# Altium project CoredunioNet_Project.PrjPcb
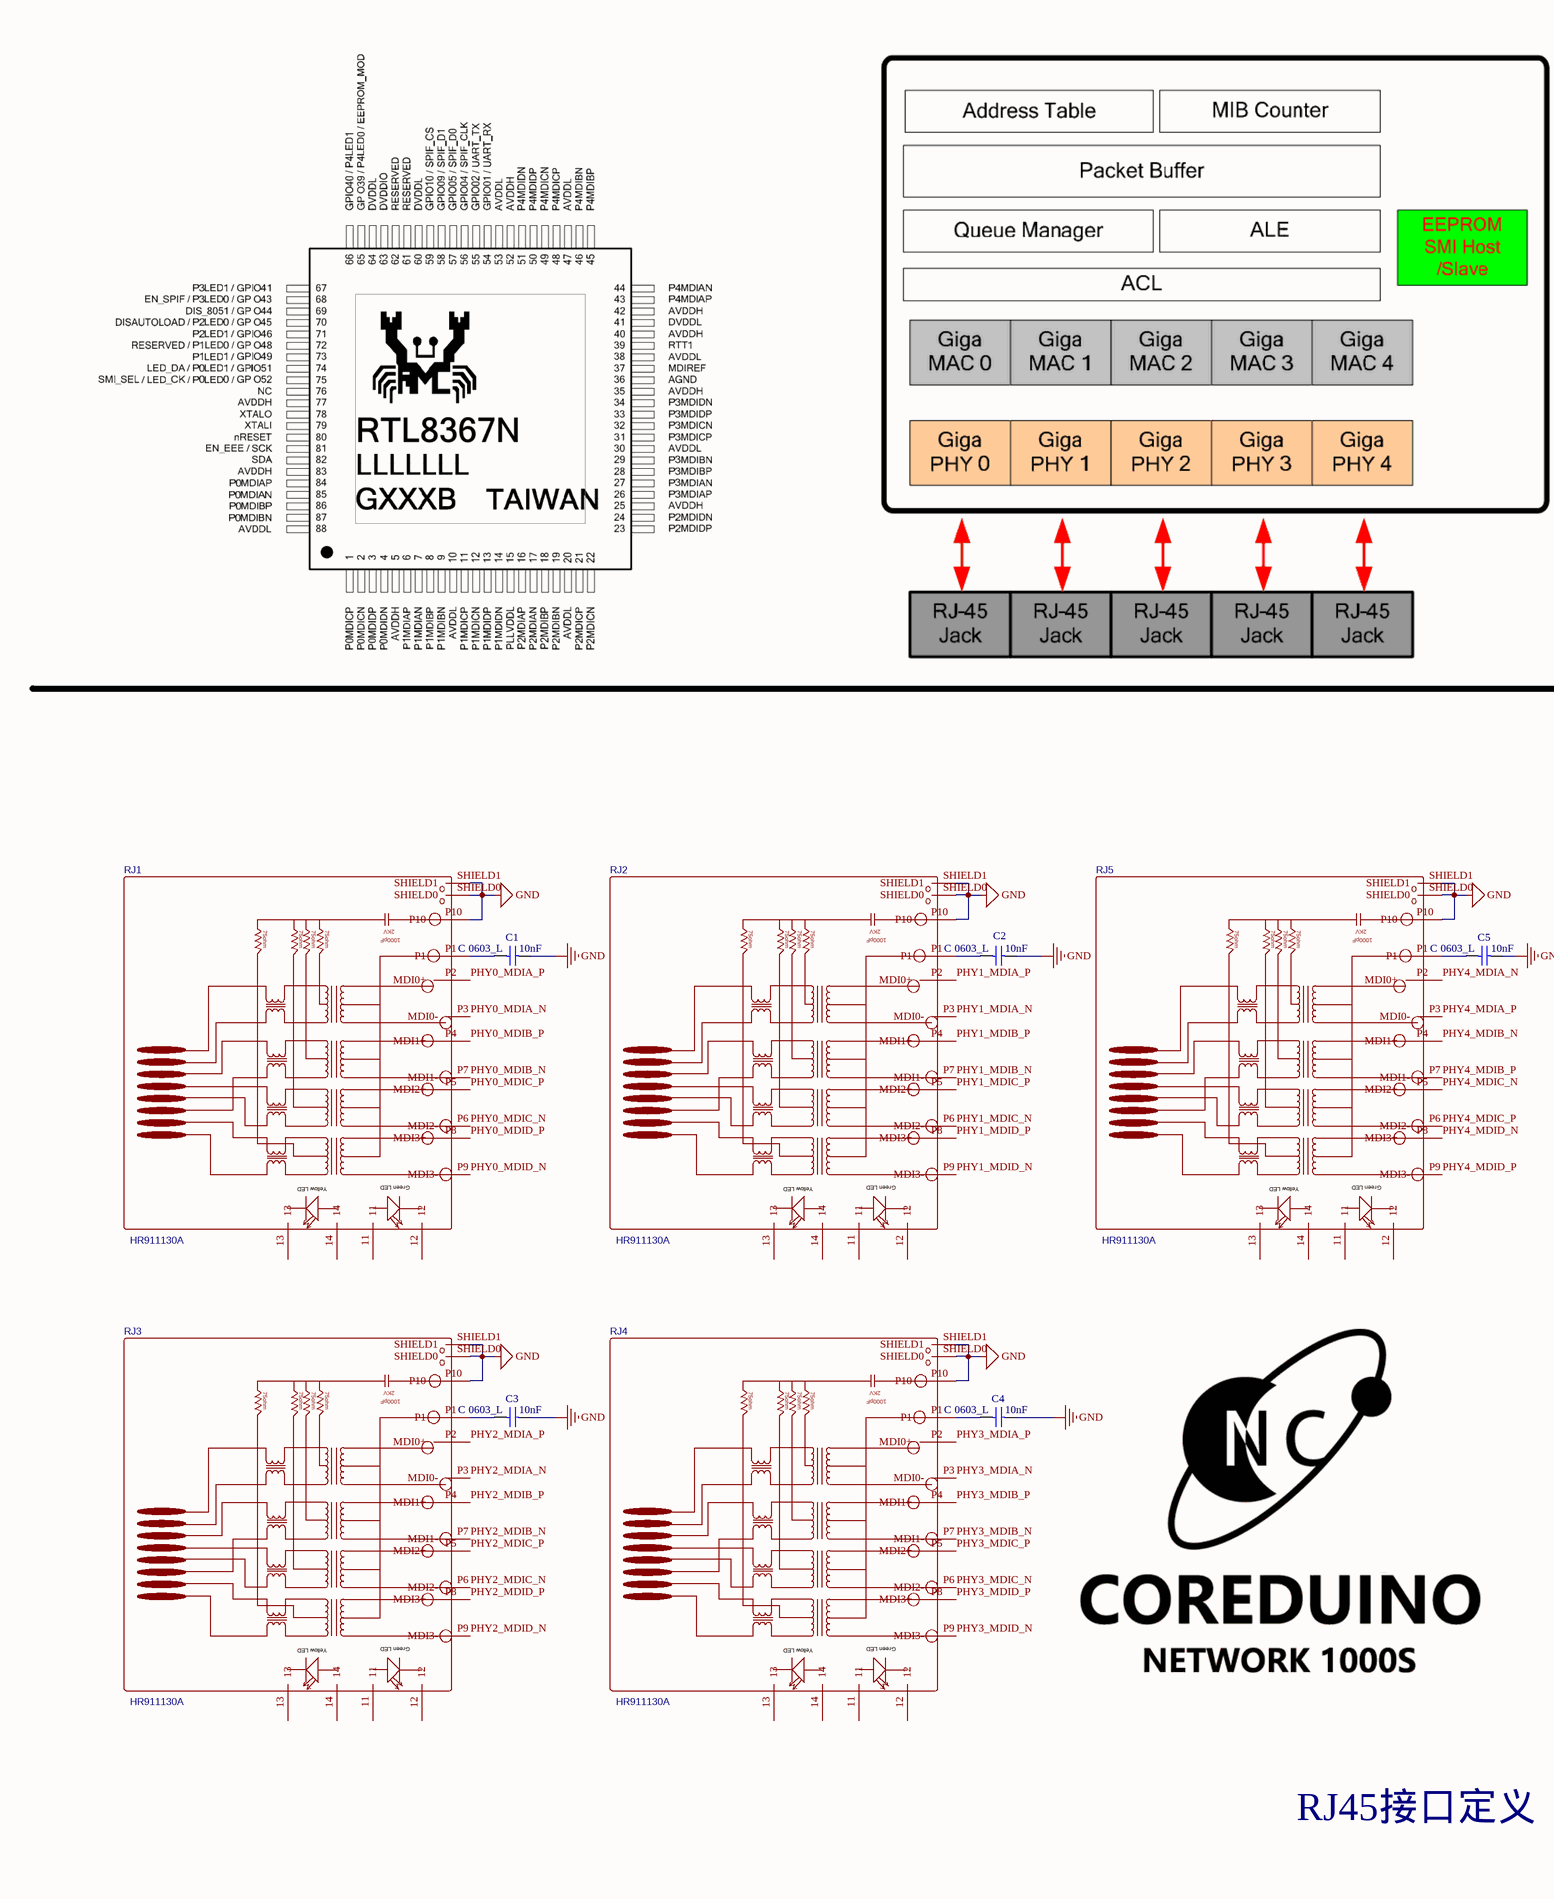
[diagram p0: Sheet1.SchDoc, left]
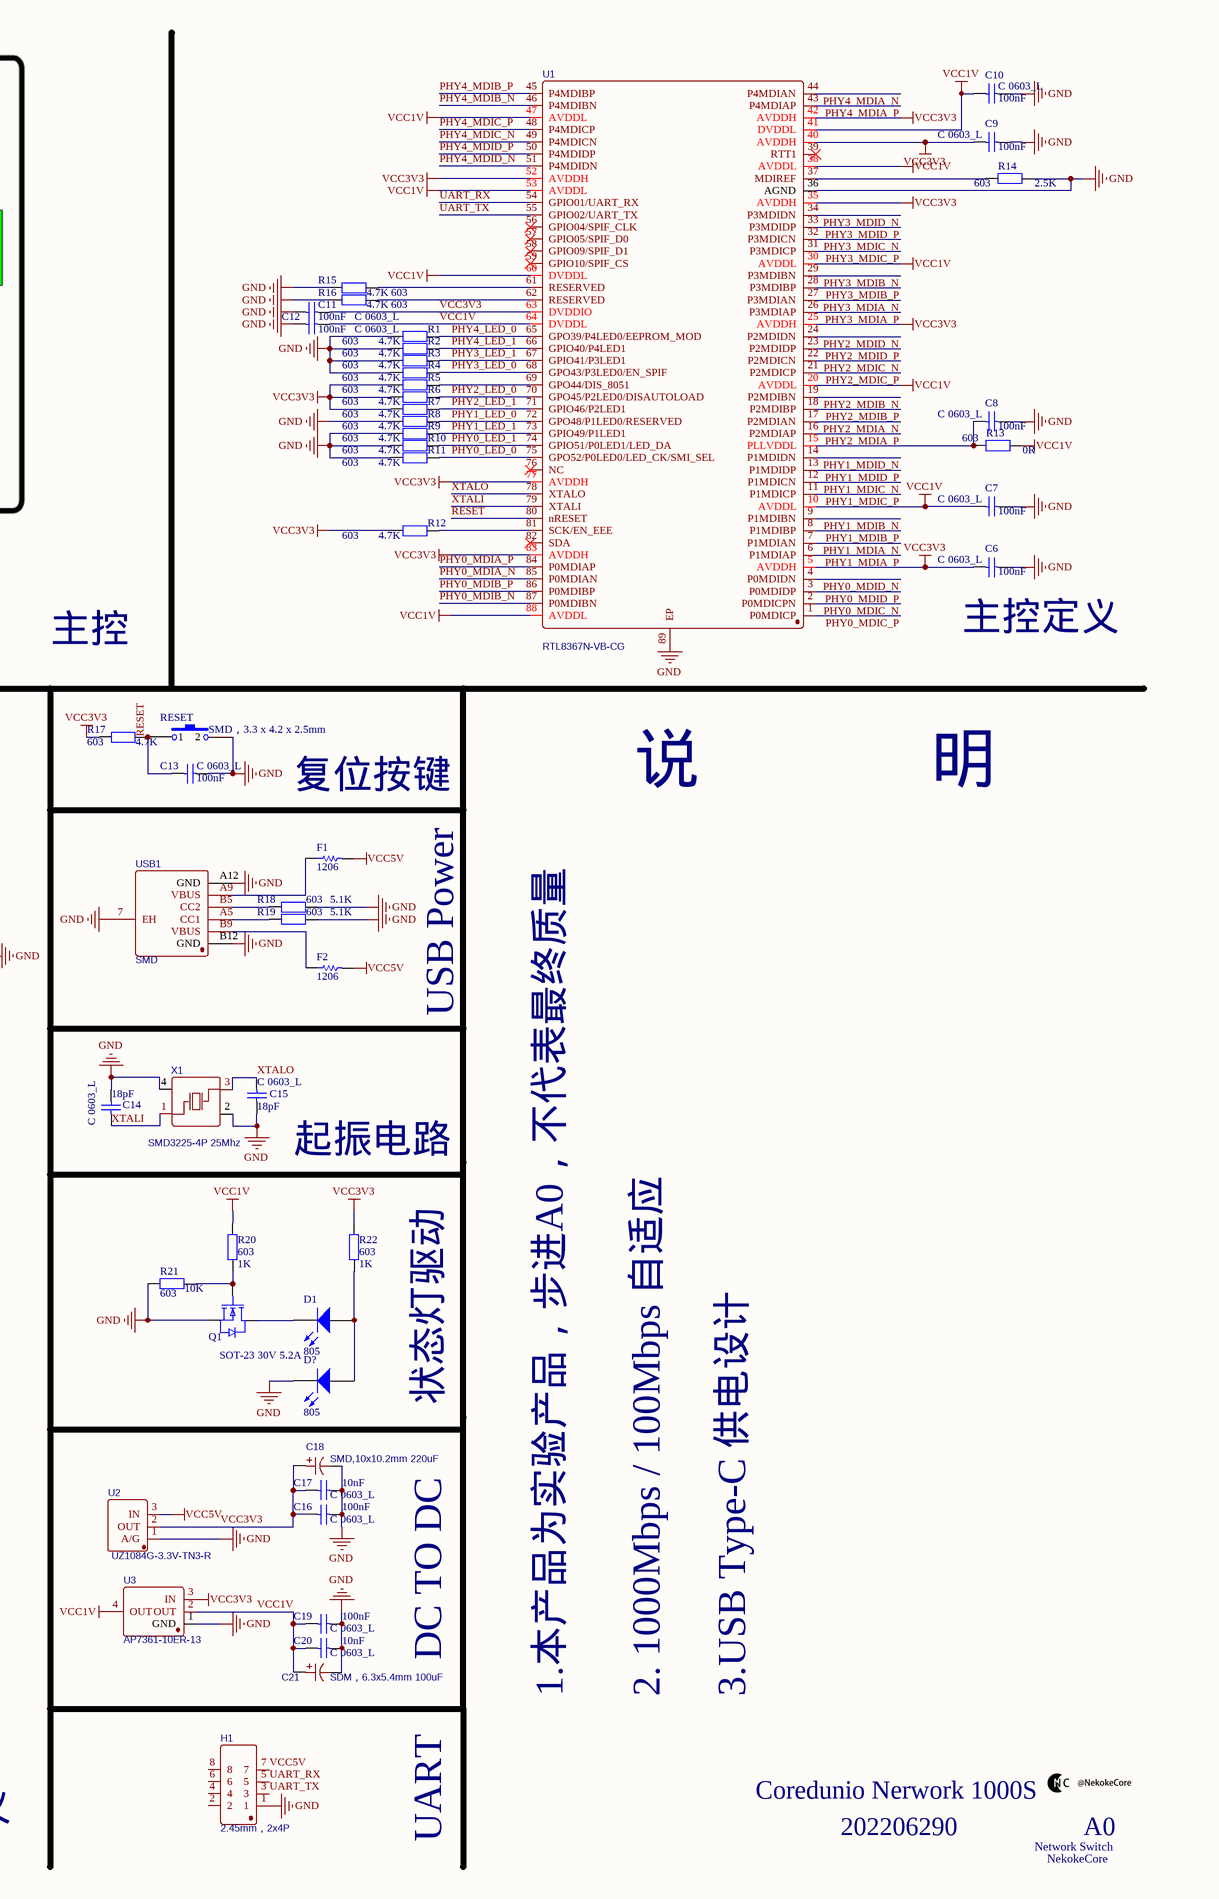
[diagram p1: Sheet1.SchDoc, right]
1 sheet, 60 parts. Net scope: global (net labels, ports and power ports of the same name join across sheets).

## Sheet Sheet1.SchDoc
size A2; SheetNumber: 1; SheetTotal: 1

### Parts
C1  C 0603_L  value 10nF  [C 0603_L]
C2  C 0603_L  value 10nF  [C 0603_L]
C3  C 0603_L  value 10nF  [C 0603_L]
C4  C 0603_L  value 10nF  [C 0603_L]
C5  C 0603_L  value 10nF  [C 0603_L]
C6  C 0603_L  value 100nF  [C 0603_L]
C7  C 0603_L  value 100nF  [C 0603_L]
C8  C 0603_L  value 100nF  [C 0603_L]
C9  C 0603_L  value 100nF  [C 0603_L]
C10  C 0603_L  value 100nF  [C 0603_L]
C11  C 0603_L  value 100nF  [C 0603_L]
C12  C 0603_L  value 100nF  [C 0603_L]
C13  C 0603_L  value 100nF  [C 0603_L]
C14  C 0603_L  value 18pF  [C 0603_L]
C15  C 0603_L  value 18pF  [C 0603_L]
C16  C 0603_L  value 100nF  [C 0603_L]
C17  C 0603_L  value 10nF  [C 0603_L]
C18  SMD,10x10.2mm 220uF  [CAP-SMD_BD10.0-L10.3-W10.3-LS11.0-FD]
C19  C 0603_L  value 100nF  [C 0603_L]
C20  C 0603_L  value 10nF  [C 0603_L]
C21  SDM，6.3x5.4mm 100uF  [CAP-SMD_BD6.3-L6.6-W6.6-LS7.2-FD]
D1  805  [LED 0805G]
D?  805  [LED 0805G]
F1  1206  [FU 1206]
F2  1206  [FU 1206]
H1  2.45mm，2x4P  [HDR-TH_8P-P2.00-V-M-R2-C4-S2.00-2]
Q1  SOT-23 30V 5.2A  [AO3400A]
R1  603  value 4.7K  [R 0603_L]
R2  603  value 4.7K  [R 0603_L]
R3  603  value 4.7K  [R 0603_L]
R4  603  value 4.7K  [R 0603_L]
R5  603  value 4.7K  [R 0603_L]
R6  603  value 4.7K  [R 0603_L]
R7  603  value 4.7K  [R 0603_L]
R8  603  value 4.7K  [R 0603_L]
R9  603  value 4.7K  [R 0603_L]
R10  603  value 4.7K  [R 0603_L]
R11  603  value 4.7K  [R 0603_L]
R12  603  value 4.7K  [R 0603_L]
R13  603  value 0R  [R 0603_L]
R14  603  value 2.5K  [R 0603_L]
R15  603  value 4.7K  [R 0603_L]
R16  603  value 4.7K  [R 0603_L]
R17  603  value 4.7K  [R 0603_L]
R18  603  value 5.1K  [R 0603_L]
R19  603  value 5.1K  [R 0603_L]
R20  603  value 1K  [R 0603_L]
R21  603  value 10K  [R 0603_L]
R22  603  value 1K  [R 0603_L]
RESET  SMD，3.3 x 4.2 x 2.5mm  [SMD-3.2*4.2]
RJ1  HR911130A  [RJ45-TH_HR911130A]
RJ2  HR911130A  [RJ45-TH_HR911130A]
RJ3  HR911130A  [RJ45-TH_HR911130A]
RJ4  HR911130A  [RJ45-TH_HR911130A]
RJ5  HR911130A  [RJ45-TH_HR911130A]
U1  RTL8367N-VB-CG  [MQFN-88_L10.0-W10.0-P0.40-BL-EP8.5]
U2  UZ1084G-3.3V-TN3-R  [TO-252-3_L6.5-W5.8-P4.58-TL]
U3  AP7361-10ER-13  [SOT-223_L6.5-W3.5-P2.30-LS7.0-BR]
USB1  SMD  [TYPE-C-SMD_TYPE-C-6P]
X1  SMD3225-4P 25Mhz  [OSC-SMD_4P-L3.2-W2.5-BL]

### Nets
GND: C1.2 C2.2 C3.2 C4.2 C5.2 C6.2 C7.2 C8.2 C9.2 C10.2 C11.1 C12.1 C13.2 C14.2 C15.1 C16.2 C17.2 C18.2 C19.2 C20.2 C21.2 D?.2(K) H1.1 Q1.2(S) R1.1 R2.1 R3.1 R4.1 R8.1 R9.1 R10.1 R11.1 R14.2 R15.1 R16.1 R18.2 R19.2 R21.1 RESET.2 RJ1.P10 RJ1.SHIELD0 RJ1.SHIELD1 RJ2.P10 RJ2.SHIELD0 RJ2.SHIELD1 RJ3.P10 RJ3.SHIELD0 RJ3.SHIELD1 RJ4.P10 RJ4.SHIELD0 RJ4.SHIELD1 RJ5.P10 RJ5.SHIELD0 RJ5.SHIELD1 U1.36(AGND) U1.89(EP) U2.1(A/G) U3.1(GND) USB1.7(EH) USB1.A12(GND) USB1.B12(GND) X1.2(GND) X1.4(GND)
VCC1V: C7.1 C10.1 C12.2 C19.1 C20.1 C21.1 R13.2 R20.2 U1.10(AVDDL) U1.20(AVDDL) U1.30(AVDDL) U1.38(AVDDL) U1.41(DVDDL) U1.47(AVDDL) U1.53(AVDDL) U1.60(DVDDL) U1.64(DVDDL) U1.88(AVDDL) U3.2(OUT) U3.4(OUT)
VCC3V3: C6.1 C9.1 C11.2 C16.1 C17.1 C18.1 R5.1 R6.1 R7.1 R12.1 R17.1 R22.2 U1.5(AVDDH) U1.25(AVDDH) U1.35(AVDDH) U1.40(AVDDH) U1.42(AVDDH) U1.52(AVDDH) U1.63(DVDDIO) U1.77(AVDDH) U1.83(AVDDH) U2.2(OUT) U3.3(IN)
VCC5V: F1.2 F2.2 H1.7 U2.3(IN)
PHY0_LED_0: R11.2 U1.75(GPO52/P0LED0/LED_CK/SMI_SEL)
PHY0_LED_1: R10.2 U1.74(GPIO51/P0LED1/LED_DA)
PHY0_MDIA_N: RJ1.P3(MDI0-) U1.85(P0MDIAN)
PHY0_MDIA_P: RJ1.P2(MDI0+) U1.84(P0MDIAP)
PHY0_MDIB_N: RJ1.P7(MDI1-) U1.87(P0MDIBN)
PHY0_MDIB_P: RJ1.P4(MDI1+) U1.86(P0MDIBP)
PHY0_MDIC_N: RJ1.P6(MDI2-) U1.2(P0MDICPN)
PHY0_MDIC_P: RJ1.P5(MDI2+) U1.1(P0MDICP)
PHY0_MDID_N: RJ1.P9(MDI3-) U1.4(P0MDIDN)
PHY0_MDID_P: RJ1.P8(MDI3+) U1.3(P0MDIDP)
PHY1_LED_0: R8.2 U1.72(GPO48/P1LED0/RESERVED)
PHY1_LED_1: R9.2 U1.73(GPIO49/P1LED1)
PHY1_MDIA_N: RJ2.P3(MDI0-) U1.7(P1MDIAN)
PHY1_MDIA_P: RJ2.P2(MDI0+) U1.6(P1MDIAP)
PHY1_MDIB_N: RJ2.P7(MDI1-) U1.9(P1MDIBN)
PHY1_MDIB_P: RJ2.P4(MDI1+) U1.8(P1MDIBP)
PHY1_MDIC_N: RJ2.P6(MDI2-) U1.12(P1MDICN)
PHY1_MDIC_P: RJ2.P5(MDI2+) U1.11(P1MDICP)
PHY1_MDID_N: RJ2.P9(MDI3-) U1.14(P1MDIDN)
PHY1_MDID_P: RJ2.P8(MDI3+) U1.13(P1MDIDP)
PHY2_LED_0: R6.2 U1.70(GPO45/P2LED0/DISAUTOLOAD)
PHY2_LED_1: R7.2 U1.71(GPIO46/P2LED1)
PHY2_MDIA_N: RJ3.P3(MDI0-) U1.17(P2MDIAN)
PHY2_MDIA_P: RJ3.P2(MDI0+) U1.16(P2MDIAP)
PHY2_MDIB_N: RJ3.P7(MDI1-) U1.19(P2MDIBN)
PHY2_MDIB_P: RJ3.P4(MDI1+) U1.18(P2MDIBP)
PHY2_MDIC_N: RJ3.P6(MDI2-) U1.22(P2MDICN)
PHY2_MDIC_P: RJ3.P5(MDI2+) U1.21(P2MDICP)
PHY2_MDID_N: RJ3.P9(MDI3-) U1.24(P2MDIDN)
PHY2_MDID_P: RJ3.P8(MDI3+) U1.23(P2MDIDP)
PHY3_LED_0: R4.2 U1.68(GPO43/P3LED0/EN_SPIF)
PHY3_LED_1: R3.2 U1.67(GPIO41/P3LED1)
PHY3_MDIA_N: RJ4.P3(MDI0-) U1.27(P3MDIAN)
PHY3_MDIA_P: RJ4.P2(MDI0+) U1.26(P3MDIAP)
PHY3_MDIB_N: RJ4.P7(MDI1-) U1.29(P3MDIBN)
PHY3_MDIB_P: RJ4.P4(MDI1+) U1.28(P3MDIBP)
PHY3_MDIC_N: RJ4.P6(MDI2-) U1.32(P3MDICN)
PHY3_MDIC_P: RJ4.P5(MDI2+) U1.31(P3MDICP)
PHY3_MDID_N: RJ4.P9(MDI3-) U1.34(P3MDIDN)
PHY3_MDID_P: RJ4.P8(MDI3+) U1.33(P3MDIDP)
PHY4_LED_0: R1.2 U1.65(GPO39/P4LED0/EEPROM_MOD)
PHY4_LED_1: R2.2 U1.66(GPIO40/P4LED1)
PHY4_MDIA_N: RJ5.P2(MDI0+) U1.44(P4MDIAN)
PHY4_MDIA_P: RJ5.P3(MDI0-) U1.43(P4MDIAP)
PHY4_MDIB_N: RJ5.P4(MDI1+) U1.46(P4MDIBN)
PHY4_MDIB_P: RJ5.P7(MDI1-) U1.45(P4MDIBP)
PHY4_MDIC_N: RJ5.P5(MDI2+) U1.49(P4MDICN)
PHY4_MDIC_P: RJ5.P6(MDI2-) U1.48(P4MDICP)
PHY4_MDID_N: RJ5.P8(MDI3+) U1.51(P4MDIDN)
PHY4_MDID_P: RJ5.P9(MDI3-) U1.50(P4MDIDP)
RESET: C13.1 R17.2 RESET.1 U1.80(nRESET)
UART_RX: H1.5 U1.54(GPIO01/UART_RX)
UART_TX: H1.3 U1.55(GPIO02/UART_TX)
XTALI: C14.1 U1.79(XTALI) X1.1(OSC1)
XTALO: C15.2 U1.78(XTALO) X1.3(OSC2)
NetC1_1: C1.1 RJ1.P1
NetC2_1: C2.1 RJ2.P1
NetC3_1: C3.1 RJ3.P1
NetC4_1: C4.1 RJ4.P1
NetC5_1: C5.1 RJ5.P1
NetC8_1: C8.1 R13.1 U1.15(PLLVDDL)
NetD1_1: D1.1(A) D?.1(A) R22.1
NetD1_2: D1.2(K) Q1.3(D)
NetF1_1: F1.1 USB1.A9(VBUS)
NetF2_1: F2.1 USB1.B9(VBUS)
NetQ1_1: Q1.1(G) R20.1 R21.2
NetR5_2: R5.2 U1.69(GPO44/DIS_8051)
NetR12_2: R12.2 U1.81(SCK/EN_EEE)
NetR14_1: R14.1 U1.37(MDIREF)
NetR15_2: R15.2 U1.61(RESERVED)
NetR16_2: R16.2 U1.62(RESERVED)
NetR18_1: R18.1 USB1.B5(CC2)
NetR19_1: R19.1 USB1.A5(CC1)

Not connected (* = marked no-connect by the designer): H1 2 4 6 8; RJ1 11 12 13 14; RJ2 11 12 13 14; RJ3 11 12 13 14; RJ4 11 12 13 14; RJ5 11 12 13 14; U1 39(RTT1)* 56(GPIO04/SPIF_CLK)* 57(GPIO05/SPIF_D0)* 58(GPIO09/SPIF_D1)* 59(GPIO10/SPIF_CS)* 76(NC)* 82(SDA)*

### Notes on the sheet
- 主控
- (near C6) 主控定义
- 复位按键
- 说              明
- USB Power
- (near C15) 起振电路
- 状态灯驱动
- DC TO DC
- 1.本产品为实验产品，步进A0，不代表最终质量
- 2. 1000Mbps / 100Mbps 自适应
- 3.USB Type-C 供电设计
- Coredunio Nerwork 1000S
- RJ45接口定义
- UART
- 202206290
- Network Switch
- NekokeCore
- A0
- (in symbol HR911130A) 2KV; 75ohm; 1000pF; J1 TX+; J2 TX-; J3 RX+; J4; J5; J6 RX-; J7; J8; Yellow LED; Green LED

### Library data of the parts
C1-C17 C19 C20 = C 0603_L: 贴片电容器（Capacitor）; Published: 8-Jun-2000; LatestRevisionDate: 17-Jul-2002; LatestRevisionNote: Re-released for DXP Platform.; PackageReference: RAD-0.3; Publisher: Altium Limited; PackageDescription: Radial Cap, Thru-Hole; 2 Leads; 0.3 in Pin Spacing
C18 = RVT220UF50V67RV0021: 贴片铝电解电容器（Capacitor）; BOM_Manufacturer: KNSCHA(科尼盛); nameAlias: Capacitance; Contributor: LCSC; BOM_Supplier: LCSC; BOM_Supplier Part: C2887271; BOM_Manufacturer Part: RVT220UF50V67RV0021; BOM_JLCPCB Part Class: Extended Part; spicePre: C; spiceSymbolName: RVT220UF50V67RV0021
C21 = RVT100UF16V67RV0016: 贴片铝电解电容器（Capacitor）; BOM_Manufacturer: KNSCHA(科尼盛); nameAlias: Capacitance; Contributor: LCSC; BOM_Supplier: LCSC; BOM_Supplier Part: C2887276; BOM_Manufacturer Part: RVT100UF16V67RV0016; BOM_JLCPCB Part Class: Extended Part; spicePre: C; spiceSymbolName: RVT100UF16V67RV0016
D1 D? = LED 0805G 绿: 贴片发光二极管（LED）; Published: 8-Jun-2000; LatestRevisionDate: 08-Jul-2005; LatestRevisionNote: Mech Layer 1 removed.; PackageReference: LED-0; Publisher: Altium Limited; PackageDescription: LED; 2 Leads
F1 F2 = nsmd150: 自恢复保险丝（Fuse）; Published: 8-Jun-2000; LatestRevisionDate: 17-Jul-2002; LatestRevisionNote: Re-released for DXP Platform.; PackageReference: AXIAL-0.3; Publisher: Altium Limited; PackageDescription: Axial Device, Thru-Hole; 2 Leads; 0.3 in Pin Spacing
H1 = PH-01519: 排针（Pin Jack）; BOM_Manufacturer: Liansheng(连盛); Contributor: LCSC; BOM_Supplier: LCSC; BOM_Supplier Part: C2827500; BOM_Manufacturer Part: PH-01519; BOM_JLCPCB Part Class: Extended Part; spicePre: H; spiceSymbolName: PH-01519
Q1 = AO3400A: 场效应管（MOSFET）; Manufacturer: Nexperia(安世); Symbol: 2N7002,215; Add into BOM: yes; Type: N沟道; Drain Source Voltage (Vdss): 60V; Continuous Drain Current (Id): 300mA; Power Dissipation (Pd): 830mW; Drain Source On Resistance (RDS(on)@Vgs,Id): 5Ω@10V,500mA; Gate Threshold Voltage (Vgs(th)@Id): 2.5V@250A; Device: 2N7002,215; LCSC Part Name: N沟道 60V 300mA; Supplier Part: C65189; Manufacturer Part: 2N7002,215; Supplier Footprint: SOT-23(SOT-23-3); JLCPCB Part Class: Extended Part; Datasheet: https://atta.szlcsc.com/upload/public/pdf/source/20170103/1483439882638.pdf; Supplier: LCSC; Convert to PCB: yes
R1-R22 = R 0603_L: 贴片电阻（Resistor）; Published: 8-Jun-2000; LatestRevisionDate: 17-Jul-2002; LatestRevisionNote: Re-released for DXP Platform.; PackageReference: AXIAL-0.4; Publisher: Altium Limited; PackageDescription: Axial Device, Thru-Hole; 2 Leads; 0.4 in Pin Spacing
RESET = 260GF: 轻触开关（Touch Switch）; Published: 24-Mar-1999; LatestRevisionDate: 17-Jul-2002; LatestRevisionNote: Re-released for DXP Platform.; PackageReference: SPST-2; Publisher: Altium Limited; PackageDescription: Switch; 2 Leads
RJ1-RJ5 = HR911130A: 单插带灯以太网接口（RJ45）; BOM_Manufacturer: HANRUN; BOM_Supplier: LCSC; BOM_Manufacturer Part: HR911130A; BOM_Supplier Part: C54408; BOM_JLCPCB Part Class: Extended Part; spicePre: R; spiceSymbolName: HR911130A
U1 = RTL8367N-VB-CG: 以太网芯片（Network）; BOM_Manufacturer: REALTEK(瑞昱); Contributor: LCSC; BOM_Supplier: LCSC; BOM_Supplier Part: C2760851; BOM_Manufacturer Part: RTL8367N-VB-CG; BOM_JLCPCB Part Class: Extended Part; spicePre: U; spiceSymbolName: RTL8367N-VB-CG
U2 = UZ1084G-3.3V-TN3-R: 线性稳压器（LDO）; BOM_Manufacturer: UTC; BOM_Supplier: LCSC; BOM_Manufacturer Part: UZ1084G-3.3V-TN3-R; BOM_Supplier Part: C84897; BOM_JLCPCB Part Class: Extended Part; spicePre: U; spiceSymbolName: UZ1084G-3.3V-TN3-R
U3 = AP7361-10ER-13: 线性稳压器（LDO）; BOM_Manufacturer: Diodes Incorporated; Contributor: LCSC; BOM_Supplier: LCSC; BOM_Supplier Part: C460389; BOM_Manufacturer Part: AP7361-10ER-13; BOM_JLCPCB Part Class: Extended Part; spicePre: U; spiceSymbolName: AP7361-10ER-13
USB1 = TYPE-C 6P QT: 通用通信总线接口（USB）; BOM_Manufacturer: SHOU HAN; Contributor: LCSC; BOM_Supplier: LCSC; BOM_Supplier Part: C456012; BOM_Manufacturer Part: TYPE-C 6P; BOM_JLCPCB Part Class: Extended Part; spicePre: U; spiceSymbolName: TYPE-C 6P
X1 = XXCEELNANF-25MHZ: 无源晶振（Crystal）; BOM_Manufacturer: TAITIEN Elec; nameAlias: Frequency; Contributor: LCSC; BOM_Supplier: LCSC; BOM_Supplier Part: C117869; BOM_Manufacturer Part: XXCEELNANF-25MHZ; BOM_JLCPCB Part Class: Extended Part; spicePre: X; spiceSymbolName: XXCEELNANF-25MHZ